# Altium schematic sheet ESP32.SchDoc
size A4
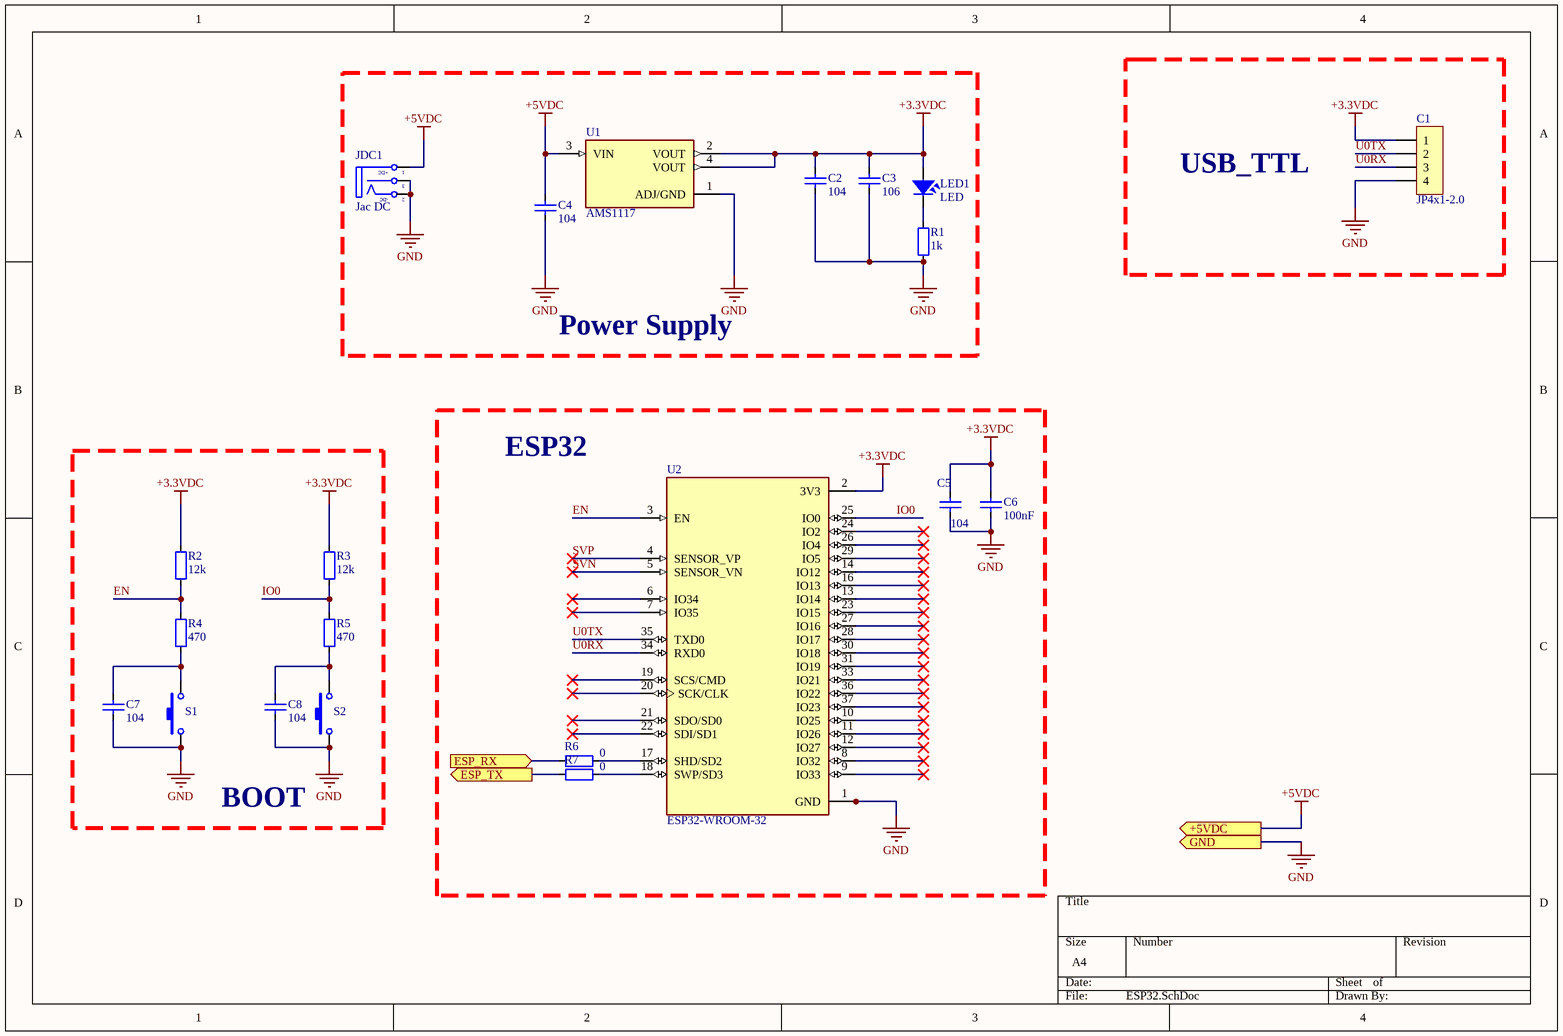
[diagram p0: ESP32.SchDoc]

## Parts
C1  JP4x1-2.0  [J4-D1T]
C2  104  [CAP_0805]
C3  106  [CAP_0805]
C4  104  [CAP_0805]
C5  104  [CAP_0805]
C6  100nF  [CAP_0805]
C7  104  [CAP_0805]
C8  104  [CAP_0805]
JDC1  Jac DC  [DC-IN]
LED1  LED  [LED-0805-Red]
R1  1k  [RES-SMD-0805]
R2  12k  [RES-SMD-0805]
R3  12k  [RES-SMD-0805]
R4  470  [RES-SMD-0805]
R5  470  [RES-SMD-0805]
R6  0  [RES-SMD-0805]
R7  0  [RES-SMD-0805]
S1  SW-SMD  [SW-SMD]  (value not drawn)
S2  SW-SMD  [SW-SMD]  (value not drawn)
U1  AMS1117  [SOT229P700X180-4N]
U2  ESP32-WROOM-32  [MODULE_ESP32-WROOM-32]

## Blocks framed on the sheet
Power Supply: C2-C4 JDC1 LED1 R1 U1
USB_TTL: C1
ESP32: C5 C6 R6 R7 U2
BOOT: C7 C8 R2-R5 S1 S2

## Ports
+5VDC (out), ESP_RX (in), ESP_TX (out), GND (out)

## Nets
+3.3VDC: C1.1 C2.2 C3.2 C5.2 C6.2 LED1.1 R2.1 R3.1 U1.2(VOUT) U1.4(VOUT) U2.2(3V3)
+5VDC: C4.2 JDC1.1(T) U1.3(VIN) ; port +5VDC
GND: C1.4 C2.1 C3.1 C4.1 C5.1 C6.1 C7.1 C8.1 JDC1.2(TN) JDC1.3(S) R1.1 S1.1 S2.1 U1.1(ADJ/GND) U2.1(GND) U2.15(GND) U2.38(GND) U2.39_1(GND) U2.39_2(GND) U2.39_3(GND) U2.39_4(GND) U2.39_5(GND) U2.39_6(GND) U2.39_7(GND) U2.39_8(GND) U2.39_9(GND) U2.39_10(GND) U2.39_11(GND) U2.39_12(GND) U2.39_13(GND) U2.39_14(GND) U2.39_15(GND) U2.39_16(GND) U2.39_17(GND) U2.39_18(GND) U2.39_19(GND) U2.39_20(GND) U2.39_21(GND) ; port GND
EN: R2.2 R4.1 U2.3(EN)
ESP_RX: R6.1 ; port ESP_RX
ESP_TX: R7.1 ; port ESP_TX
IO0: R3.2 R5.1 U2.25(IO0)
SVN: U2.5(SENSOR_VN)
SVP: U2.4(SENSOR_VP)
U0RX: C1.3 U2.34(RXD0)
U0TX: C1.2 U2.35(TXD0)
NetC7_2: C7.2 R4.2 S1.2
NetC8_2: C8.2 R5.2 S2.2
NetLED1_2: LED1.2 R1.2
NetR6_2: R6.2 U2.17(SHD/SD2)
NetR7_2: R7.2 U2.18(SWP/SD3)

Not connected (* = marked no-connect by the designer): U2 6(IO34)* 7(IO35)* 8(IO32)* 9(IO33)* 10(IO25)* 11(IO26)* 12(IO27)* 13(IO14)* 14(IO12)* 16(IO13)* 19(SCS/CMD)* 20(SCK/CLK)* 21(SDO/SD0)* 22(SDI/SD1)* 23(IO15)* 24(IO2)* 26(IO4)* 27(IO16)* 28(IO17)* 29(IO5)* 30(IO18)* 31(IO19)* 33(IO21)* 36(IO22)* 37(IO23)*

## Notes on the sheet
- (in symbol DCIN) +DC; -DC

## Library data of the parts
C1 = JP4x1-2.0: WR-PHD 2.00 mm Socket Header; Manufacturer: W¨¹rth Elektronik eiSos GmbH; partNo: 62000411821; ComponentLink1 Description: Manufacturer; ComponentLink2 Description: Datasheet; NoPins: 04; Created Date: 2 April 2013; ComponentLink1URL: http://www.we-online.com; ComponentLink2URL: http://katalog.we-online.de/em/datasheet/6200xx11821.pdf; Created by: Karrer Zheng
C2-C8 = CapSMD: Capacitor; Value: 33p; Published: 8-Jun-2000; LatestRevisionDate: 17-Jul-2002; LatestRevisionNote: Re-released for DXP Platform.; PackageReference: RAD-0.3; Publisher: Altium Limited
JDC1 = DCIN: Jac DC input; Value: Jac DC
LED1 = LED: LED Single colour Green and Red; Value: LED 3 ly Single Colour
R1-R7 = Resistor - SMD: Resistor; Manufacturer: Generic Components; Class: Passive; Published: 08/06/2000; Publisher: Altium Hobart Technology Centre
S1 S2 = SW-SMD: Switch; Published: 24-Mar-1999; LatestRevisionDate: 17-Jul-2002; LatestRevisionNote: Re-released for DXP Platform.; PackageReference: SPST-2; Publisher: Altium Limited
U1 = AMS1117: 1A LOW DROPOUT VOLTAGE REGULATOR SOT-223; MF: Advanced Monolithic Systems; Price: None; Availability: Not in stock; Package: SOT-223 Seeed Technology; MP: AMS1117; Value: *; SnapEDA_Link: https://www.snapeda.com/parts/AMS1117/Advanced+Monolithic+Systems/view-part/?ref=snap; Check_prices: https://www.snapeda.com/parts/AMS1117/Advanced+Monolithic+Systems/view-part/?ref=eda
U2 = ESP32-WROOM-32: Bluetooth, WiFi Transceiver Module 2.4GHz ~ 2.5GHz Surface Mount; MF: Espressif Systems; Package: Module Espressif Systems; Digi-Key_Part_Number: 1904-1010-1-ND; Digi-Key_Purchase_URL: https://www.digikey.com/product-detail/en/espressif-systems/ESP32-WROOM-32/1904-1010-1-ND/8544305?utm_source=snapeda&utm_medium=aggregator&utm_campaign=symbol; Value: *; MP: ESP32-WROOM-32; SnapEDA_Link: https://www.snapeda.com/parts/ESP32-WROOM-32/Espressif%20Systems/view-part/2753322/?ref=snap